# EAGLE design Aula 02 (EAGLE 6.2)
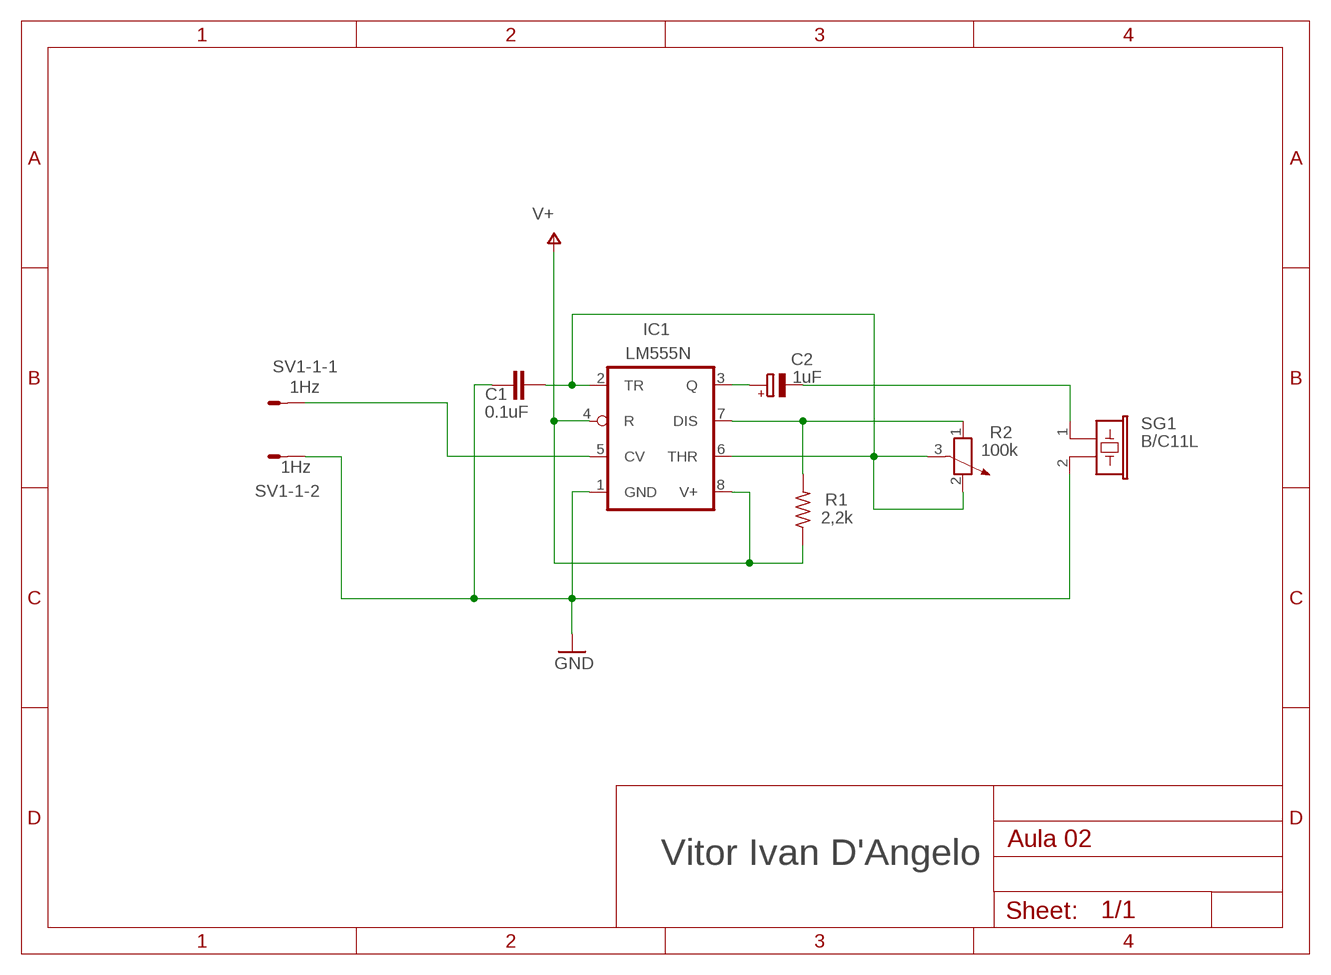
[diagram p0: schematic, sheet 1]

## Parts
C1  0.1uF  C-EU025-040X050  [C025-040X050]
C2  1uF  CPOL-EUE2-5  [E2-5]
IC1  LM555N  [DIL08]
R1  2,2k  R-US_0204/7  [0204/7]
R2  100k  POTENTIOMETER_PT-10  [PT-10]
SG1  B/C11L  [B/C11L]
SV1-1  1Hz  L02P  [L02P]

## Nets
GND: C1.1 IC1.1(GND) SG1.2 SV1-1.2
N$1: C1.2 IC1.2(TR) IC1.6(THR) R2.2 R2.3
N$2: C2.+ IC1.3(Q)
N$4: IC1.5(CV) SV1-1.1
N$5: C2.- SG1.1
N$6: IC1.7(DIS) R1.2 R2.1
V+: IC1.4(R) IC1.8(V+) R1.1

## Notes on the sheet
- Vitor Ivan D'Angelo

## Library data of the parts
C1 = rcl:C-EU: CAPACITOR, European symbol
C2 = rcl:CPOL-EU: POLARIZED CAPACITOR, European symbol
IC1 = linear:*555: TIMER
R1 = rcl:R-US_: RESISTOR, American symbol
R2 = rcl:POTENTIOMETER_: Potentiometer
SG1 = buzzer:B/C11L: BUZZER Source: Buerklin; OC_FARNELL: unknown; OC_NEWARK: unknown
SV1-1 = con-amp-mt:L02P: AMP MT CONNECTOR; OC_FARNELL: unknown; OC_NEWARK: unknown

## Board
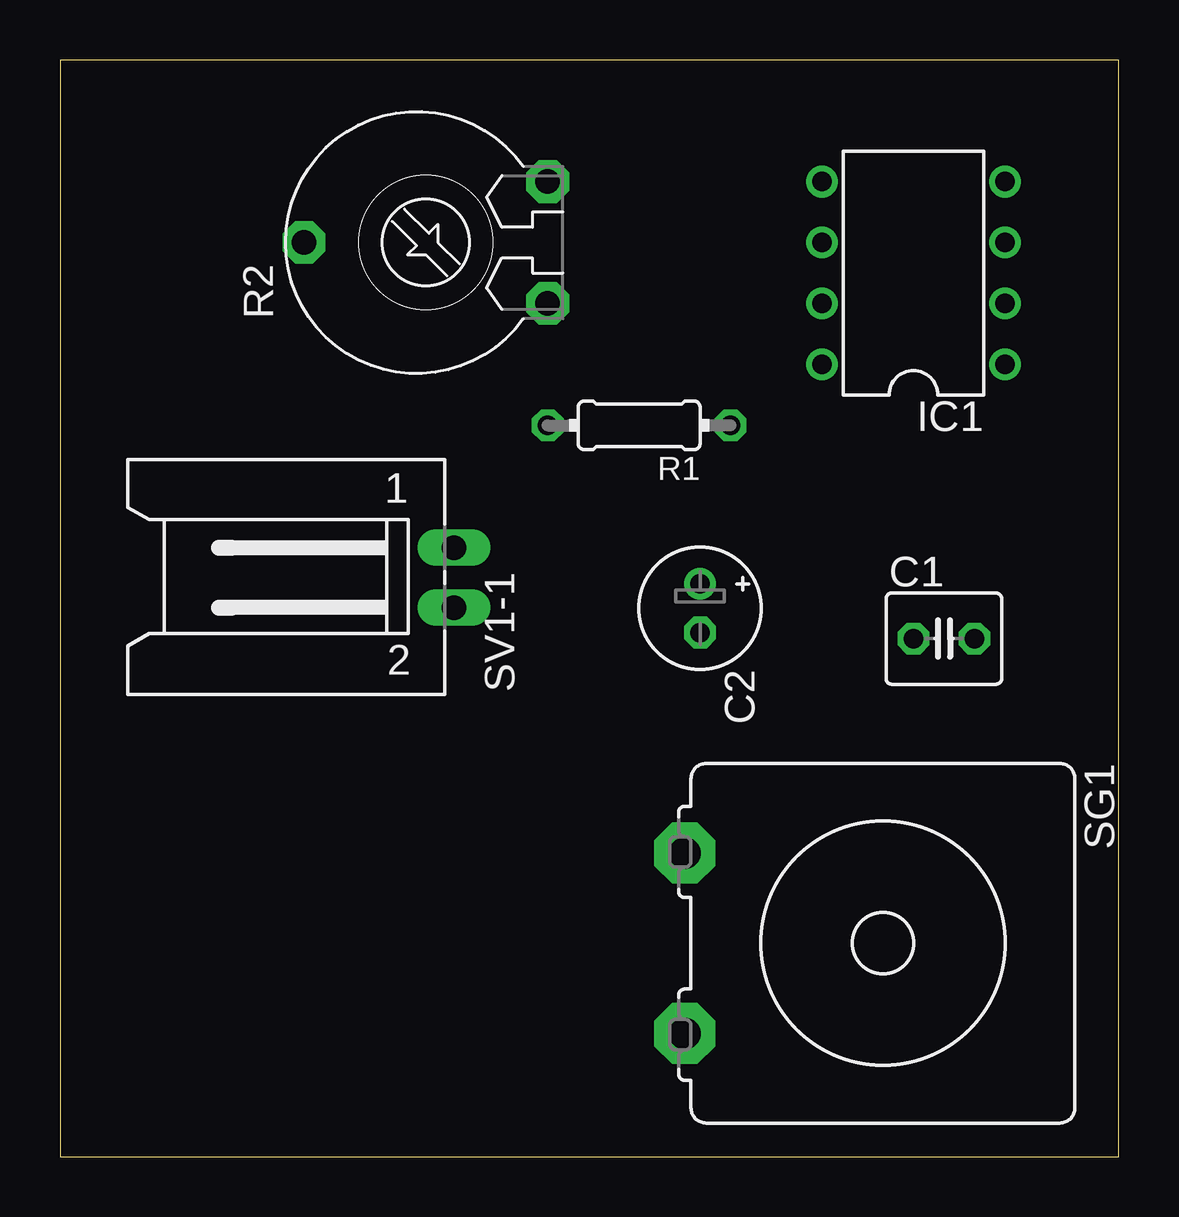
[diagram p1: board, top side]
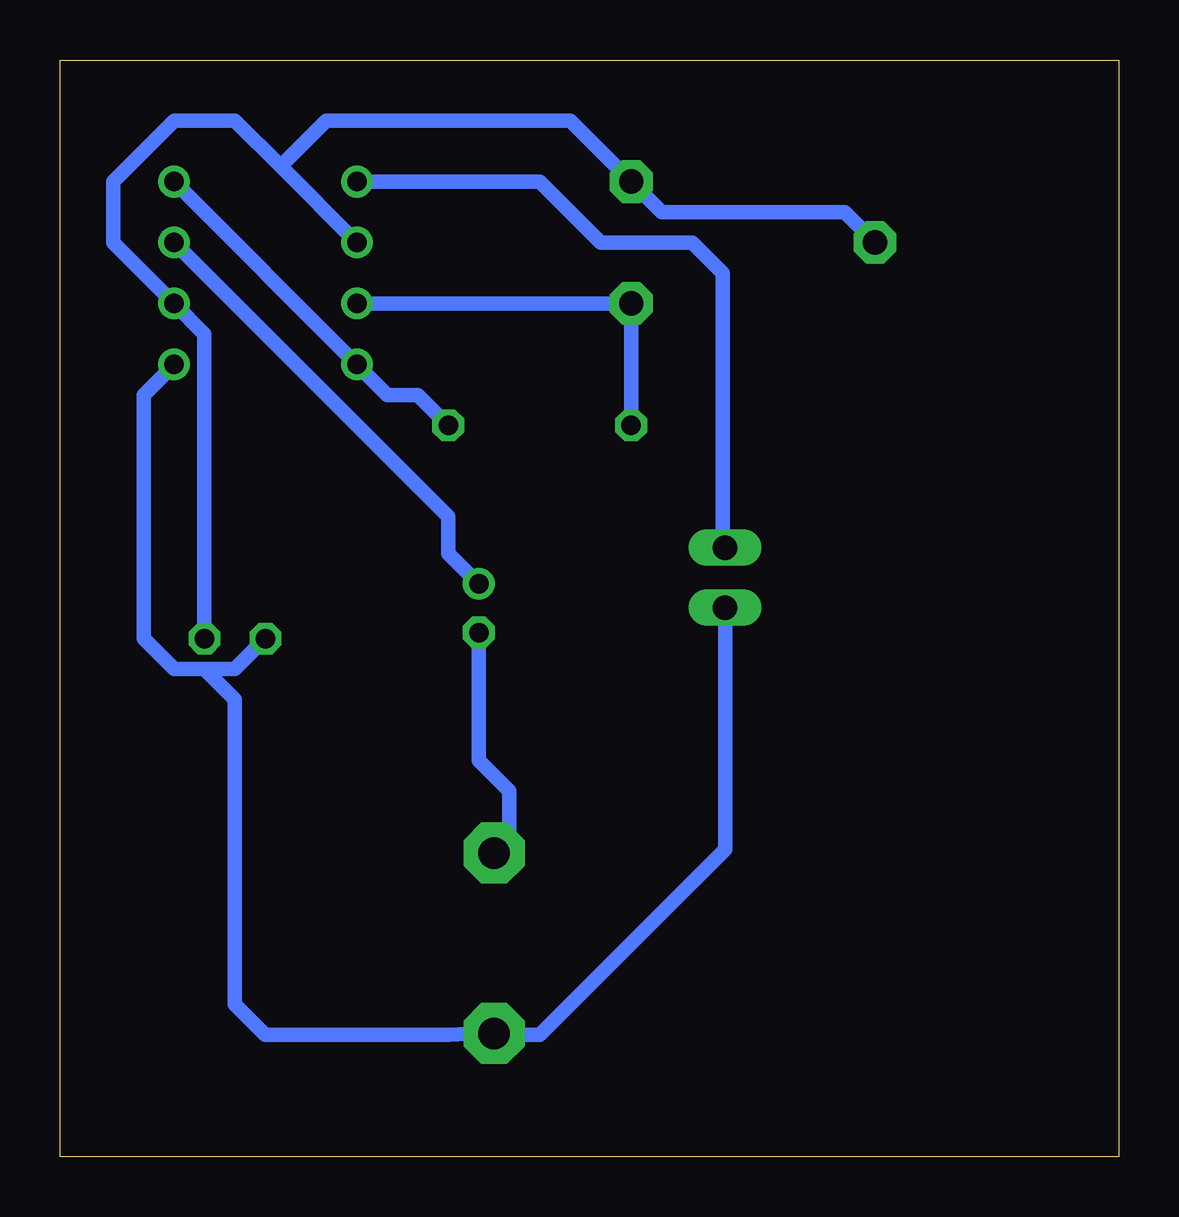
[diagram p2: board, bottom side, seen from below]

Size 44.12 x 45.71 mm. Coordinates in mm from the lower left corner, seen from the top.
Outline: 0,0 44.12,0 44.12,45.71 0,45.71 0,0
Copper layers (1*16): Top 0.035mm / dielectric 1.5mm / Bottom 0.035mm
Design rules: minimum track width 10mil, minimum drill 24mil, track to track 8mil, track to pad 8mil, pad to pad 8mil, via to via 8mil, smd to smd 8mil, copper to edge 40mil, drill to drill 8mil, minimum pad ring 10mil, minimum via ring 8mil, stop-mask expansion 4mil, vias tented up to drill 0mil, thermal gap 10mil

### Footprints (pad centres in the part's own frame; a part is rotated, then mirrored left to right if it is on the bottom)
C025-040X050 = drill 0.813 octagon: 1 -1.27,0; 2 1.27,0
E2-5 = drill 0.813 pad 1.27: + -1.016,0 | drill 0.813 pad 1.27 octagon: - 1.016,0
DIL08 = drill 0.813 pad 1.27: 1 -3.81,-3.81; 2 -1.27,-3.81; 3 1.27,-3.81; 4 3.81,-3.81; 5 3.81,3.81; 6 1.27,3.81; 7 -1.27,3.81; 8 -3.81,3.81
0204/7 = drill 0.813 octagon: 1 -3.81,0; 2 3.81,0
PT-10 = drill 1.016 pad 1.778 octagon: 1 -2.54,-5.08; 2 2.54,-5.08; 3 0,5.08
B/C11L = drill 1.321 pad 2.54 octagon: 1 -3.759,-8.255; 2 3.759,-8.255
L02P = drill 1.016 long: 1 1.25,-6.25; 2 -1.25,-6.25

### Placement (x,y rotation side)
C1  36.83,21.59 0 top
C2  26.67,22.86 270 top
IC1  35.56,36.83 90 top
R1  24.13,30.48 180 top
R2  15.24,38.1 90 top
SG1  34.29,8.89 270 top
SV1-1  10.16,24.13 90 top

### Tracks (layer width: path | path; a pad name or v marks a point on that pad's centre or on a via)
GND
  Bottom 0.61: IC1.1 40.64,31.75 40.64,21.59 39.37,20.32 38.1,20.32 | 38.1,20.32 36.83,20.32 C1.1 | 38.1,20.32 36.83,19.05 36.83,6.35 35.56,5.08 27.94,5.08 26.72,5.13 SG1.2 25.98,5.08 24.13,5.08 16.41,12.8 SV1-1.2
N$1
  Bottom 0.61: C1.2 38.1,34.29 IC1.2 41.91,38.1 41.91,40.64 39.37,43.18 36.83,43.18 34.92,41.27 | R2.3 11.43,39.37 19.05,39.37 R2.2 22.86,43.18 33.02,43.18 34.92,41.27 | IC1.6 34.92,41.27
N$2
  Bottom 0.61: IC1.3 27.94,26.67 27.94,25.15 C2.+
N$4
  Bottom 0.61: IC1.5 24.13,40.64 21.59,38.1 17.78,38.1 16.51,36.83 16.51,25.48 SV1-1.1
N$5
  Bottom 0.61: C2.- 26.67,16.51 25.4,15.24 25.4,13.28 SG1.1
N$6
  Bottom 0.61: IC1.7 R2.1 R1.2
V+
  Bottom 0.61: IC1.4 IC1.8 30.48,31.75 29.21,31.75 R1.1